# EAGLE schematic L003-ShiftRegister - Schematic (EAGLE 7.7.0)
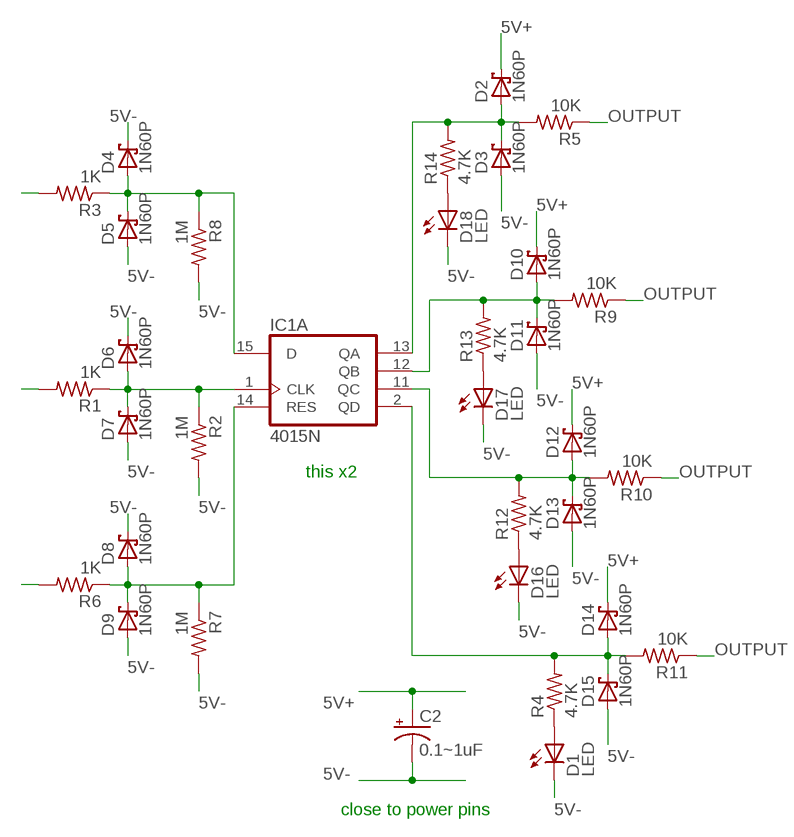
[diagram p0: schematic, sheet 1]

## Parts
C2  0.1~1uF  CPOL-USE2.5-6  [E2,5-6]
D1  LED  SFH482  [SFH482]
D2  1N60P  1N5817-B  [DO41-7.6]
D3  1N60P  1N5817-B  [DO41-7.6]
D4  1N60P  1N5817-B  [DO41-7.6]
D5  1N60P  1N5817-B  [DO41-7.6]
D6  1N60P  1N5817-B  [DO41-7.6]
D7  1N60P  1N5817-B  [DO41-7.6]
D8  1N60P  1N5817-B  [DO41-7.6]
D9  1N60P  1N5817-B  [DO41-7.6]
D10  1N60P  1N5817-B  [DO41-7.6]
D11  1N60P  1N5817-B  [DO41-7.6]
D12  1N60P  1N5817-B  [DO41-7.6]
D13  1N60P  1N5817-B  [DO41-7.6]
D14  1N60P  1N5817-B  [DO41-7.6]
D15  1N60P  1N5817-B  [DO41-7.6]
D16  LED  SFH482  [SFH482]
D17  LED  SFH482  [SFH482]
D18  LED  SFH482  [SFH482]
IC1  4015N  [DIL16]
R1  1K  R-US_VMTA55  [VMTA55]
R2  1M  R-US_VMTA55  [VMTA55]
R3  1K  R-US_VMTA55  [VMTA55]
R4  4.7K  R-US_VMTA55  [VMTA55]
R5  10K  R-US_VMTA55  [VMTA55]
R6  1K  R-US_VMTA55  [VMTA55]
R7  1M  R-US_VMTA55  [VMTA55]
R8  1M  R-US_VMTA55  [VMTA55]
R9  10K  R-US_VMTA55  [VMTA55]
R10  10K  R-US_VMTA55  [VMTA55]
R11  10K  R-US_VMTA55  [VMTA55]
R12  4.7K  R-US_VMTA55  [VMTA55]
R13  4.7K  R-US_VMTA55  [VMTA55]
R14  4.7K  R-US_VMTA55  [VMTA55]

## Nets
5V+: C2.+ D2.C D10.C D12.C D14.C
5V-: C2.- D1.K(C) D3.A D4.C D5.A D6.C D7.A D8.C D9.A D11.A D13.A D15.A D16.K(C) D17.K(C) D18.K(C) R2.2 R7.2 R8.2
N$1: D4.A D5.C IC1.15(A:D) R3.1 R8.1
N$2: R3.2
N$3: D1.A R4.1
N$4: D2.A D3.C IC1.13(A:QA) R5.2 R14.2
N$5: D17.A R13.1
N$6: D6.A D7.C IC1.1(A:CLK) R1.1 R2.1
N$7: D8.A D9.C IC1.14(A:RES) R6.1 R7.1
N$8: R6.2
N$9: R1.2
N$10: D10.A D11.C IC1.12(A:QB) R9.2 R13.2
N$11: D12.A D13.C IC1.11(A:QC) R10.2 R12.2
N$12: D14.A D15.C IC1.2(A:QD) R4.2 R11.2
N$13: D18.A R14.1
N$14: D16.A R12.1
OUTPUT: R5.1 R9.1 R10.1 R11.1
Unconnected: IC1.3(B:QC) IC1.4(B:QB) IC1.5(B:QA) IC1.6(B:RES) IC1.7(B:D) IC1.9(B:CLK) IC1.10(B:QD)

## Notes on the sheet
- this x2
- close to power pins

## Power pins joined to a net without a drawn wire
VDD: IC1.16(P:VDD)
VSS: IC1.8(P:VSS)

## Library data of the parts
C2 = rcl:CPOL-US: POLARIZED CAPACITOR, American symbol
D1 D16-D18 = led:SFH482: IR LED infrared emitting diode, Infineon
D2-D15 = diode:1N581*: 1.0A SCHOTTKY BARRIER RECTIFIER Source: http://www.diodes.com/datasheets/ds23001.pdf
IC1 = 40xx:4015: Dual 4-bit static SHIFT REGISTER
R1-R14 = resistor:R-US_: RESISTOR, American symbol